# EAGLE schematic Team_14_DRAFT_03 (EAGLE 8.3.2)
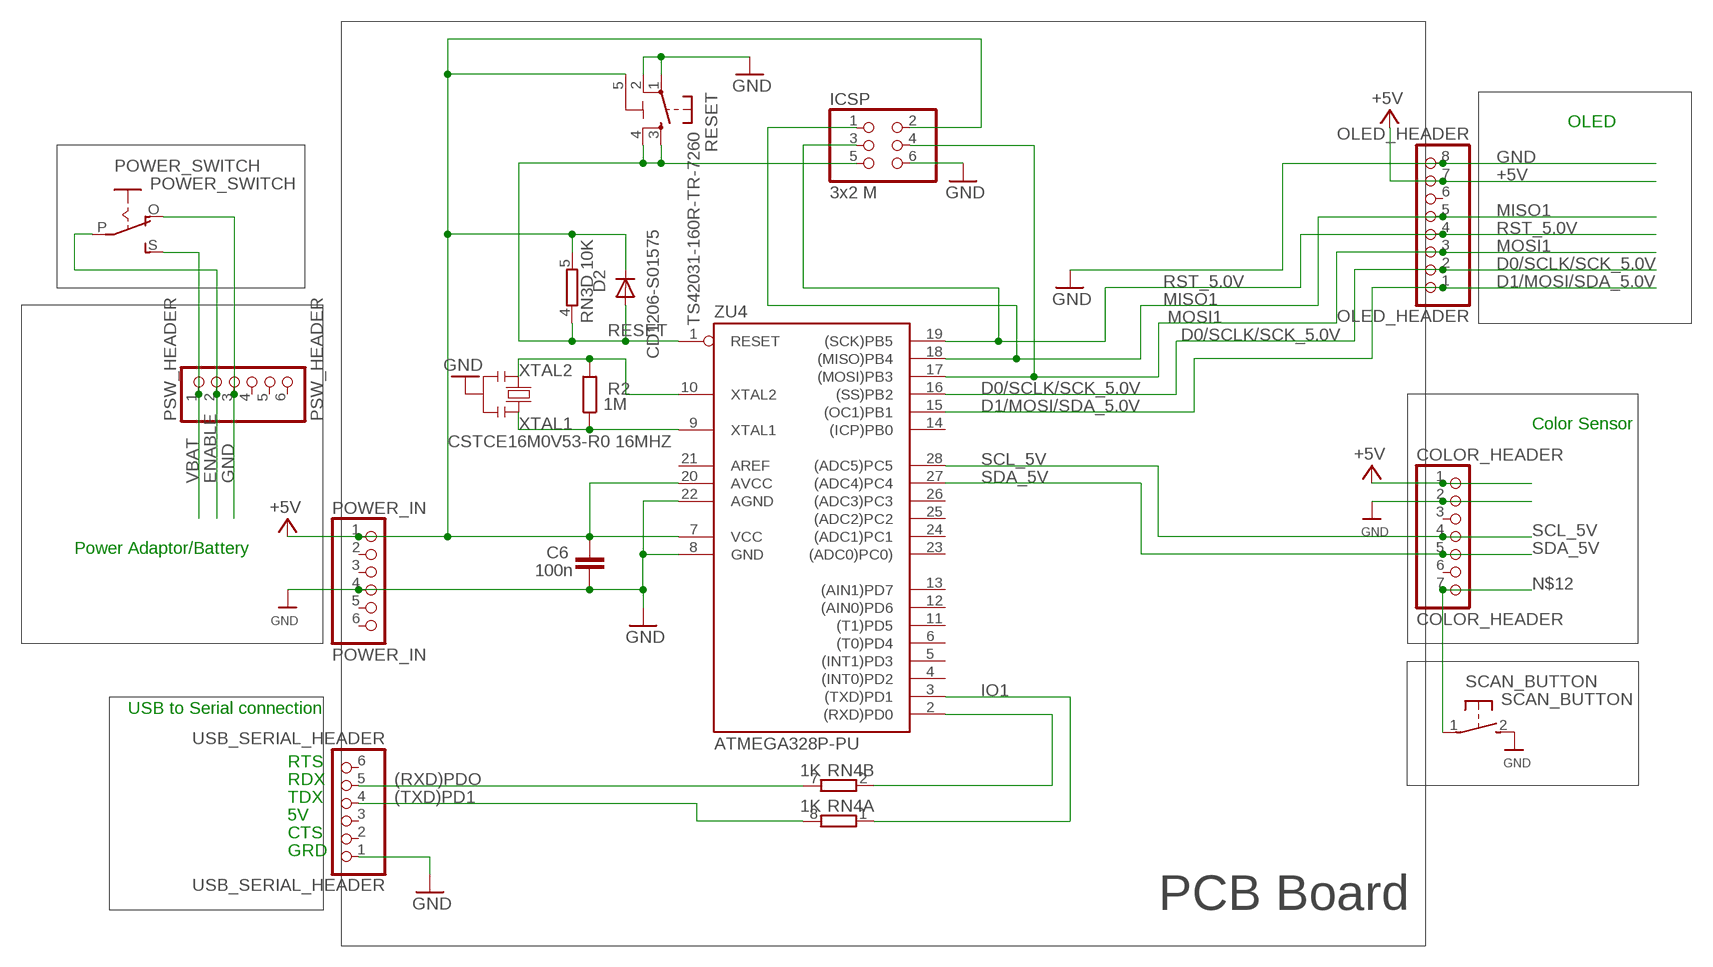
[diagram p0: schematic, sheet 1]

## Parts
C6  100n  C-EU0603-RND  [C0603-ROUND]
COLOR_HEADER  COLOR_HEADER  HEADER-1X770MIL  [1X07_ROUND_70]
D2  CD1206-S01575  DIODE-MINIMELF  [MINIMELF]
ICSP  3x2 M  PINHD-2X3  [2X03]
OLED_HEADER  OLED_HEADER  HEADER-1X870MIL  [1X08_ROUND_70]
POWER_IN  POWER_IN  PINHD-1X6  [1X06]
POWER_SWITCH  POWER_SWITCH  EG1218S  [EG1218]
PSW_HEADER  PSW_HEADER  PINHD-1X6CB  [1X06-CLEANBIG]
R2  1M  R-EU_R0603  [R0603-ROUND]
RESET  TS42031-160R-TR-7260  TS42  [TS42]
RN3  10K  4R-NCAY16  [CAY16]
RN4  1K  4R-NCAY16  [CAY16]
SCAN_BUTTON  SCAN_BUTTON  31-XX  [B3F-31XX]
USB_SERIAL_HEADER  USB_SERIAL_HEADER  PINHD-1X6  [1X06]
Y2  CSTCE16M0V53-R0 16MHZ  RESONATORMU  [RESONATOR]
ZU4  ATMEGA328P-PU  [DIL28-3]

## Nets
(RXD)PDO: RN4.7 USB_SERIAL_HEADER.5
(TXD)PD1: RN4.8 USB_SERIAL_HEADER.4
+5V [usbvcc]: C6.2 COLOR_HEADER.1 D2.C ICSP.2 OLED_HEADER.7 POWER_IN.1 RESET.5(5-GND) RN3.5 ZU4.7(VCC) ZU4.20(AVCC)
D0/SCLK/SCK_5.0V: OLED_HEADER.2 ZU4.16((SS)PB2)
D1/MOSI/SDA_5.0V: OLED_HEADER.1 ZU4.15((OC1)PB1)
ENABLE: POWER_SWITCH.P PSW_HEADER.2
GND [gnd]: C6.1 COLOR_HEADER.2 ICSP.6 OLED_HEADER.8 POWER_IN.4 POWER_SWITCH.O PSW_HEADER.3 RESET.1 RESET.2 SCAN_BUTTON.2(S) USB_SERIAL_HEADER.1 Y2.2 ZU4.8(GND) ZU4.22(AGND)
IO1: RN4.1 ZU4.3((TXD)PD1)
IO11: RN4.2 ZU4.2((RXD)PD0)
MISO1: ICSP.1 OLED_HEADER.5 ZU4.18((MISO)PB4)
MOSI1: ICSP.4 OLED_HEADER.3 ZU4.17((MOSI)PB3)
N$12: COLOR_HEADER.7 SCAN_BUTTON.1(P)
RESET: D2.A ICSP.5 RESET.3 RESET.4 RN3.4 ZU4.1(RESET)
RST_5.0V: ICSP.3 OLED_HEADER.4 ZU4.19((SCK)PB5)
SCL_5V: COLOR_HEADER.4 ZU4.28((ADC5)PC5)
SDA_5V: COLOR_HEADER.5 ZU4.27((ADC4)PC4)
VBAT: POWER_SWITCH.S PSW_HEADER.1
XTAL1: R2.1 Y2.3 ZU4.9(XTAL1)
XTAL2: R2.2 Y2.1 ZU4.10(XTAL2)
Unconnected: COLOR_HEADER.3 COLOR_HEADER.6 OLED_HEADER.6 POWER_IN.2 POWER_IN.3 POWER_IN.5 POWER_IN.6 PSW_HEADER.4 PSW_HEADER.5 PSW_HEADER.6 RN3.1 RN3.2 RN3.3 RN3.6 RN3.7 RN3.8 RN4.3 RN4.4 RN4.5 RN4.6 USB_SERIAL_HEADER.2 USB_SERIAL_HEADER.3 USB_SERIAL_HEADER.6 ZU4.4((INT0)PD2) ZU4.5((INT1)PD3) ZU4.6((T0)PD4) ZU4.11((T1)PD5) ZU4.12((AIN0)PD6) ZU4.13((AIN1)PD7) ZU4.14((ICP)PB0) ZU4.21(AREF) ZU4.23((ADC0)PC0)) ZU4.24((ADC1)PC1) ZU4.25((ADC2)PC2) ZU4.26((ADC3)PC3)

## Notes on the sheet
- OLED
- Color Sensor
- Power Adaptor/Battery
- USB to Serial connection
- RTS
- RDX
- TDX
- 5V
- CTS
- GRD
- PCB Board

## Library data of the parts
C6 = SmartPrj:C-EU: CAPACITOR, European symbol
COLOR_HEADER = microbuilder:HEADER-1X7: PIN HEADER
D2 = diode:DIODE-: DIODE
ICSP = SmartPrj:PINHD-2X3: PIN HEADER
OLED_HEADER = microbuilder:HEADER-1X8: PIN HEADER
POWER_IN PSW_HEADER USB_SERIAL_HEADER = adafruit:PINHD-1X6: PIN HEADER
POWER_SWITCH = adafruit:EG1218: SLIDING SWITCH 0.1" spacing through hole, vertical SPDT slide switch http://www.ladyada.net/library/pcb/eaglelibrary.html
R2 = SmartPrj:R-EU_: RESISTOR, European symbol
RESET = SmartPrj:TS42: TS42 Dongnan Electronics Tact switch VDC 12V - 50mA
RN3 RN4 = resistor-dil:4R-N: Array Chip Resistor Source: RS Component / Phycomp
SCAN_BUTTON = adafruit:31-XX: OMRON SWITCH Now with beefier pads!
Y2 = SmartPrj:RESONATOR
ZU4 = SmartPrj:ATMEGA328P-: MICROCONTROLLER 4 Kbytes FLASH 128 bytes SRAM 256 bytes EEPROM UART 6-channel 10 bit ADC

## Net classes
1 power: width 0.61 mm, drill 0.61 mm, clearance 0.254 mm
2 gnd: width 0.305 mm, drill 0.559 mm, clearance 0.254 mm
3 usbvcc: width 0.508 mm, drill 0.61 mm, clearance 0.254 mm
4 aref: width 0.406 mm, drill 0.61 mm, clearance 0.254 mm